# Altium project RIAA Amplifier.PRJPCB
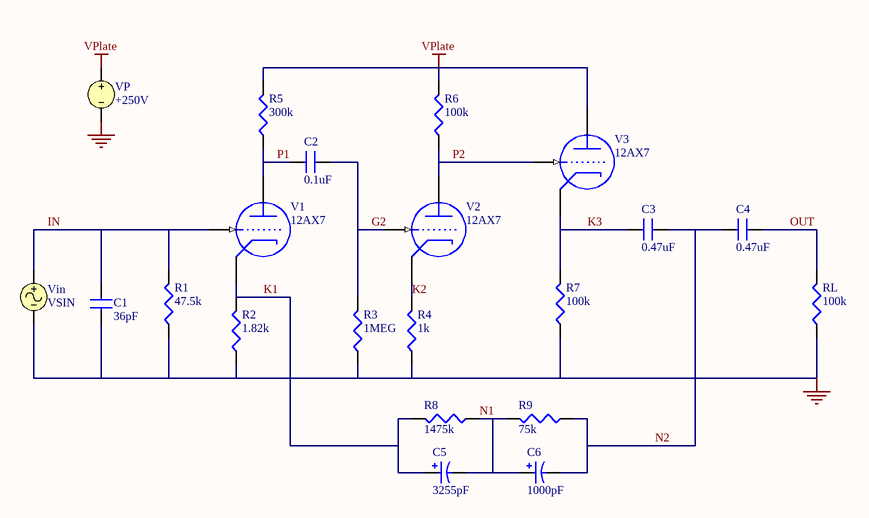
[diagram p0: RIAA Amplifier.schdoc]
1 sheet, 21 parts. Net scope: global (net labels, ports and power ports of the same name join across sheets).

## Sheet RIAA Amplifier.schdoc: RIAA Amplifier
size A4; Organization: Altium Limited; Address1: L3, 12a Rodborough Rd; Address2: Frenchs Forest; Address3: NSW; Address4: Australia 2086; DocumentNumber: 1; SheetNumber: 1; SheetTotal: 1

### Parts
C1  36pF
C2  0.1uF
C3  0.47uF
C4  0.47uF
C5  3255pF
C6  1000pF
R1  47.5k
R2  1.82k
R3  1MEG
R4  1k
R5  300k
R6  100k
R7  100k
R8  1475k
R9  75k
RL  100k
V1  12AX7
V2  12AX7
V3  12AX7
Vin  VSIN
VP  +250V

### Nets
GND: C1.2 R1.2(BOT) R2.2(BOT) R3.2(BOT) R4.2(BOT) R7.2(BOT) RL.2(BOT) Vin.2 VP.2
VPlate: R5.1(TOP) R6.1(TOP) V3.1(P) VP.1
G2: C2.2 R3.1(TOP) V2.2(G)
IN: C1.1 R1.1(TOP) V1.2(G) Vin.1
K1: C5.1 R2.1(TOP) R8.1(TOP) V1.3(K)
K2: R4.1(TOP) V2.3(K)
K3: C3.1 R7.1(TOP) V3.3(K)
N1: C5.2 C6.1 R8.2(BOT) R9.1(TOP)
N2: C3.2 C4.1 C6.2 R9.2(BOT)
OUT: C4.2 RL.1(TOP)
P1: C2.1 R5.2(BOT) V1.1(P)
P2: R6.2(BOT) V2.1(P) V3.2(G)

### Notes on the sheet
- Title
- Size:
- Date:
- A4
- Number:
- Time:
- Revision:
- Sheet
- of
- File:

### Library data of the parts
C1-C4 = CAP: Capacitor
  C1: Value: 36pF
  C2: Value: 0.1uF
  C3 C4: Value: 0.47uF
C5 C6 = CAP2: Bi-Polar Capacitor
  C5: Value: 3255pF
  C6: Value: 1000pF
R1-R9 RL = RES: Resistor
  R1: Value: 47.5k
  R2: Value: 1.82k
  R3: Value: 1MEG
  R4: Value: 1k
  R5: Value: 300k
  R6 R7 RL: Value: 100k
  R8: Value: 1475k
  R9: Value: 75k
V1-V3 = 12AX7: Triode
Vin = VSIN: Sinusoidal Voltage Source
VP = VSRC: Voltage Source; Value: +250V